# EAGLE design auxboxshield1.54 (EAGLE 6.5.0)
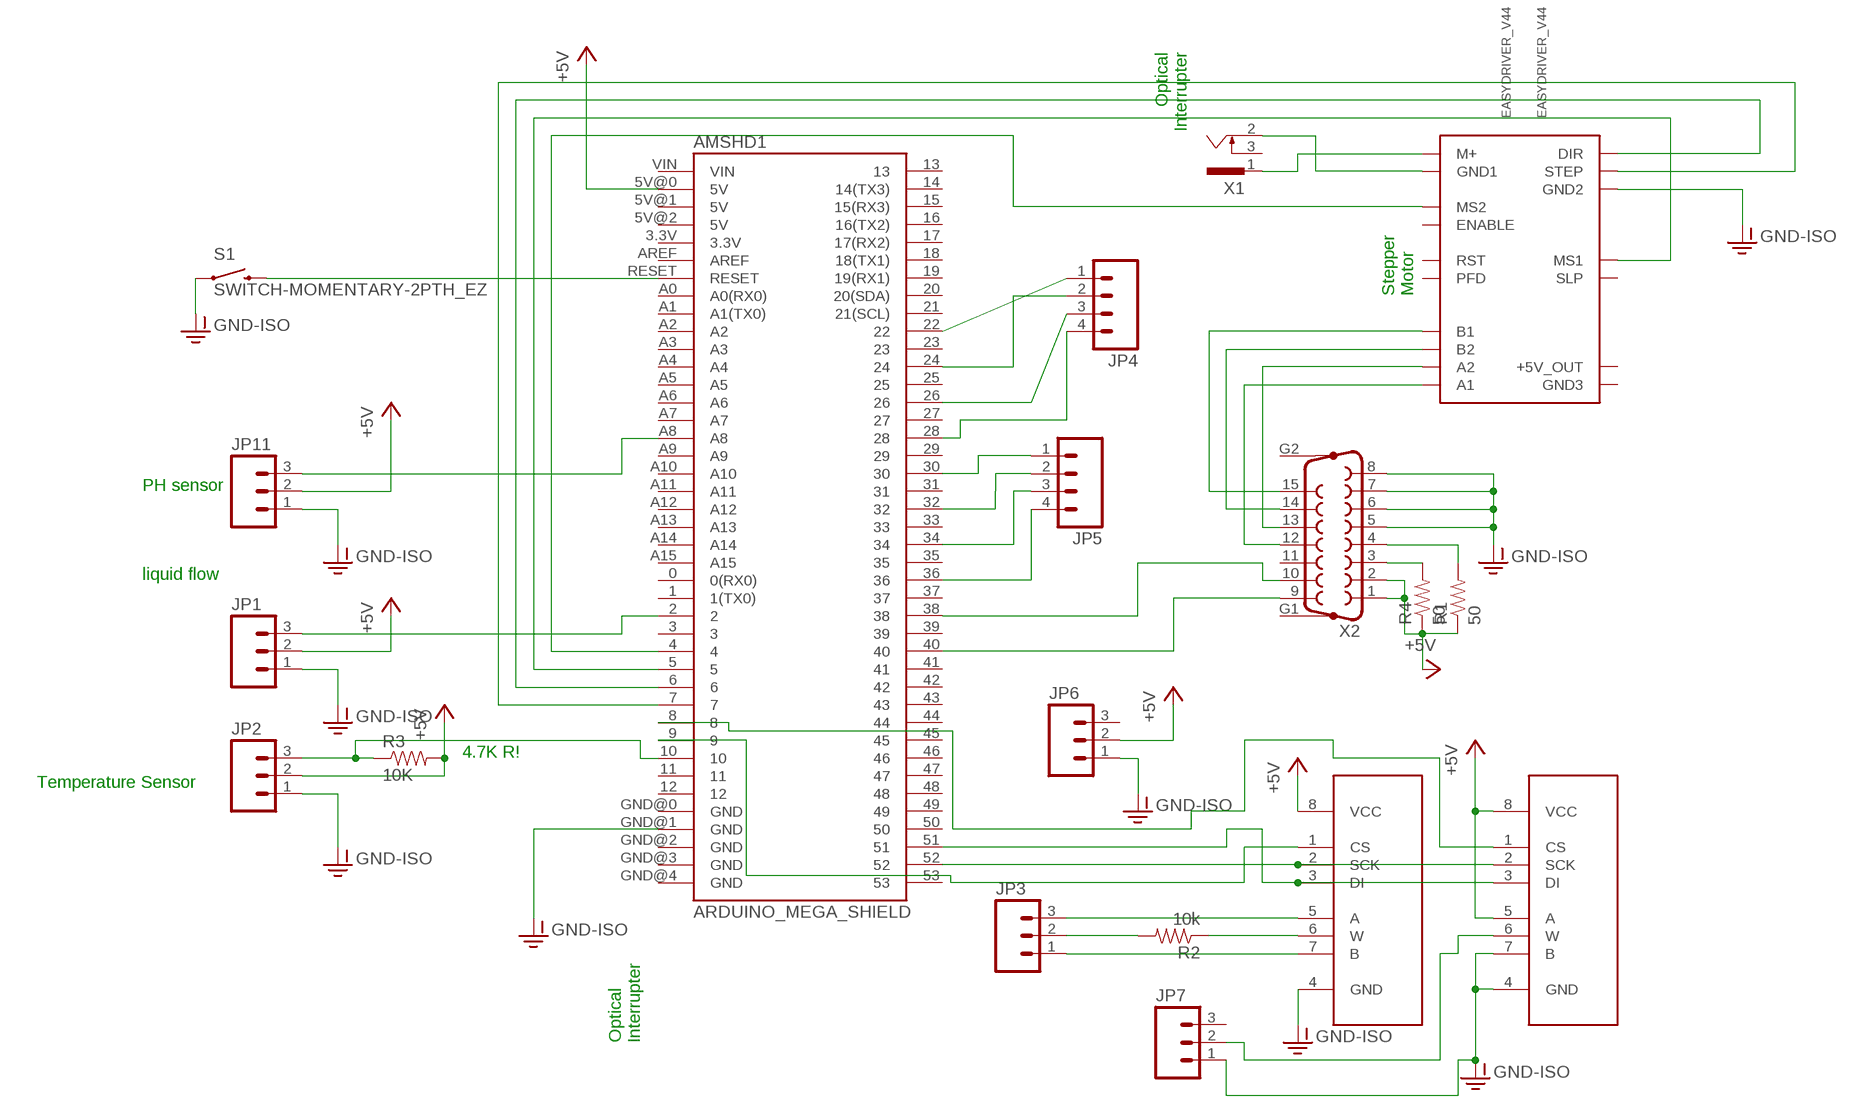
[diagram p0: schematic, sheet 1]

## Parts
AMSHD1  ARDUINO_MEGA_SHIELD  [ARDUINO_MEGA_SHIELD]
EASYDRIVER_V44  EASYDRIVER_V44  [EASYDRIVER_V44]
JP1  M03POLAR  [MOLEX-1X3]
JP2  M03POLAR  [MOLEX-1X3]
JP3  M03POLAR  [MOLEX-1X3]
JP4  M04POLAR  [MOLEX-1X4]
JP5  M04POLAR  [MOLEX-1X4]
JP6  M03POLAR  [MOLEX-1X3]
JP7  M03POLAR  [MOLEX-1X3]
JP11  M03POLAR  [MOLEX-1X3]
R1  50  10OHM-1/4W-5%(PTH)  [AXIAL-0.3]
R2  10k  10KOHM-1/4W-1%(PTH)HORIZ  [AXIAL-0.3]
R3  10K  10OHM-1/4W-5%(PTH)  [AXIAL-0.3]
R4  50  10OHM-1/4W-5%(PTH)  [AXIAL-0.3]
S1  SWITCH-MOMENTARY-2PTH_EZ  [TACTILE-PTH-EZ]
U1  MCP41XXXDIL  [DIL-08]
U2  MCP41XXXDIL  [DIL-08]
X1  SCD-014A  [SCD-014-A]
X2  F15VP  [F15VP]

## Nets
+5V: AMSHD1.5V@0(5V) JP1.2 JP2.2 JP6.2 JP11.2 R1.P$1 R3.P$2 R4.P$1 U1.5(A) U1.8(VCC) U2.8(VCC) X2.1 X2.2
GND-ISO: AMSHD1.GND@1(GND) EASYDRIVER_V44.GND2 JP1.1 JP2.1 JP6.1 JP7.1 JP11.1 S1.1 U1.4(GND) U1.7(B) U2.4(GND) X2.5 X2.6 X2.7 X2.8
N$1: EASYDRIVER_V44.M+ X1.1
N$2: AMSHD1.36 JP5.4
N$3: AMSHD1.38 X2.10
N$4: R1.P$2 X2.4
N$5: AMSHD1.22 JP4.1
N$6: EASYDRIVER_V44.GND1 X1.2
N$7: EASYDRIVER_V44.A1 X2.12
N$8: AMSHD1.24 JP4.2
N$9: AMSHD1.RESET S1.3
N$10: AMSHD1.26 JP4.3
N$11: EASYDRIVER_V44.A2 X2.13
N$12: AMSHD1.9 U2.1(CS)
N$13: AMSHD1.5 EASYDRIVER_V44.MS1
N$14: AMSHD1.28 JP4.4
N$15: AMSHD1.A8 JP11.3
N$16: AMSHD1.4 EASYDRIVER_V44.MS2
N$17: AMSHD1.52 U1.2(SCK) U2.2(SCK)
N$18: AMSHD1.30 JP5.1
N$19: AMSHD1.40 X2.9
N$20: AMSHD1.51 U1.3(DI) U2.3(DI)
N$21: JP3.3 U2.5(A)
N$22: AMSHD1.32 JP5.2
N$23: AMSHD1.34 JP5.3
N$24: R2.P$1 U2.6(W)
N$25: JP3.2 R2.P$2
N$26: AMSHD1.10 JP2.3 R3.P$1
N$27: EASYDRIVER_V44.B2 X2.14
N$28: AMSHD1.2 JP1.3
N$29: AMSHD1.6 EASYDRIVER_V44.DIR
N$30: AMSHD1.7 EASYDRIVER_V44.STEP
N$31: EASYDRIVER_V44.B1 X2.15
N$32: JP3.1 U2.7(B)
N$33: R4.P$2 X2.3
N$34: AMSHD1.8 U1.1(CS)
N$35: JP7.2 U1.6(W)
Unconnected: AMSHD1.0(0(RX0)) AMSHD1.1(1(TX0)) AMSHD1.3 AMSHD1.3.3V AMSHD1.5V@1(5V) AMSHD1.5V@2(5V) AMSHD1.11 AMSHD1.12 AMSHD1.13 AMSHD1.14(14(TX3)) AMSHD1.15(15(RX3)) AMSHD1.16(16(TX2)) AMSHD1.17(17(RX2)) AMSHD1.18(18(TX1)) AMSHD1.19(19(RX1)) AMSHD1.20(20(SDA)) AMSHD1.21(21(SCL)) AMSHD1.23 AMSHD1.25 AMSHD1.27 AMSHD1.29 AMSHD1.31 AMSHD1.33 AMSHD1.35 AMSHD1.37 AMSHD1.39 AMSHD1.41 AMSHD1.42 AMSHD1.43 AMSHD1.44 AMSHD1.45 AMSHD1.46 AMSHD1.47 AMSHD1.48 AMSHD1.49 AMSHD1.50 AMSHD1.53 AMSHD1.A0(A0(RX0)) AMSHD1.A1(A1(TX0)) AMSHD1.A2 AMSHD1.A3 AMSHD1.A4 AMSHD1.A5 AMSHD1.A6 AMSHD1.A7 AMSHD1.A9 AMSHD1.A10 AMSHD1.A11 AMSHD1.A12 AMSHD1.A13 AMSHD1.A14 AMSHD1.A15 AMSHD1.AREF AMSHD1.GND@0(GND) AMSHD1.GND@2(GND) AMSHD1.GND@3(GND) AMSHD1.GND@4(GND) AMSHD1.VIN EASYDRIVER_V44.ENABLE EASYDRIVER_V44.GND3 EASYDRIVER_V44.P$11(+5V_OUT) EASYDRIVER_V44.PFD EASYDRIVER_V44.RST EASYDRIVER_V44.SLEEP(SLP) JP6.3 JP7.3 X1.3 X2.11 X2.G1 X2.G2

## Notes on the sheet
- Optical 
  Interrupter
- Stepper
  Motor
- PH sensor
- liquid flow
- 4.7K R!
- Temperature Sensor
- Optical 
  Interrupter

## Library data of the parts
AMSHD1 = SparkFun-Boards:ARDUINO_MEGA_SHIELD
EASYDRIVER_V44 = EasyDriver:EASYDRIVER_V44: EasyDriver version 4.4 - http://www.schmalzhaus.com/EasyDriver
JP1-JP3 JP6 JP7 JP11 = SparkFun-Connectors:M03: Header 3 Standard 3-pin 0.1" header. Use with straight break away headers (SKU : PRT-00116), right angle break away headers (PRT-00553), swiss pins (PRT-00743), machine pins (PRT-00117), and female headers (PRT-00115). Molex polarized connector foot print use with SKU : PRT-08232 with associated crimp pins and housings.
JP4 JP5 = SparkFun-Connectors:M04: Header 4 Standard 4-pin 0.1" header. Use with straight break away headers (SKU : PRT-00116), right angle break away headers (PRT-00553), swiss pins (PRT-00743), machine pins (PRT-00117), and female headers (PRT-00115). Molex polarized connector foot print use with SKU : PRT-08231 with associated crimp pins and housings. 1MM SMD Version SKU: PRT-10208
R1 R3 R4 = SparkFun-Resistors:10OHM-1/4W-5%(PTH): RES-10698; PROD_ID: RES-10698; VALUE: 10
R2 = SparkFun-Resistors:10KOHM-1/4W-1%(PTH): RES-12183; PROD_ID: RES-12183
S1 = SparkFun-Electromechanical:SWITCH-MOMENTARY-2: Various NO switches- pushbuttons, reed, etc
U1 U2 = SparkFun-AnalogIC:MCP41XXX: SPI controlled single digital potentiometer by Microchip PID: COM-10613
X1 = con-shiua-chyuan:SCD-014A: Power Jack 2.5mm; OC_FARNELL: unknown; OC_NEWARK: unknown
X2 = con-subd:F15VP: SUB-D; OC_FARNELL: unknown; OC_NEWARK: unknown

## Board
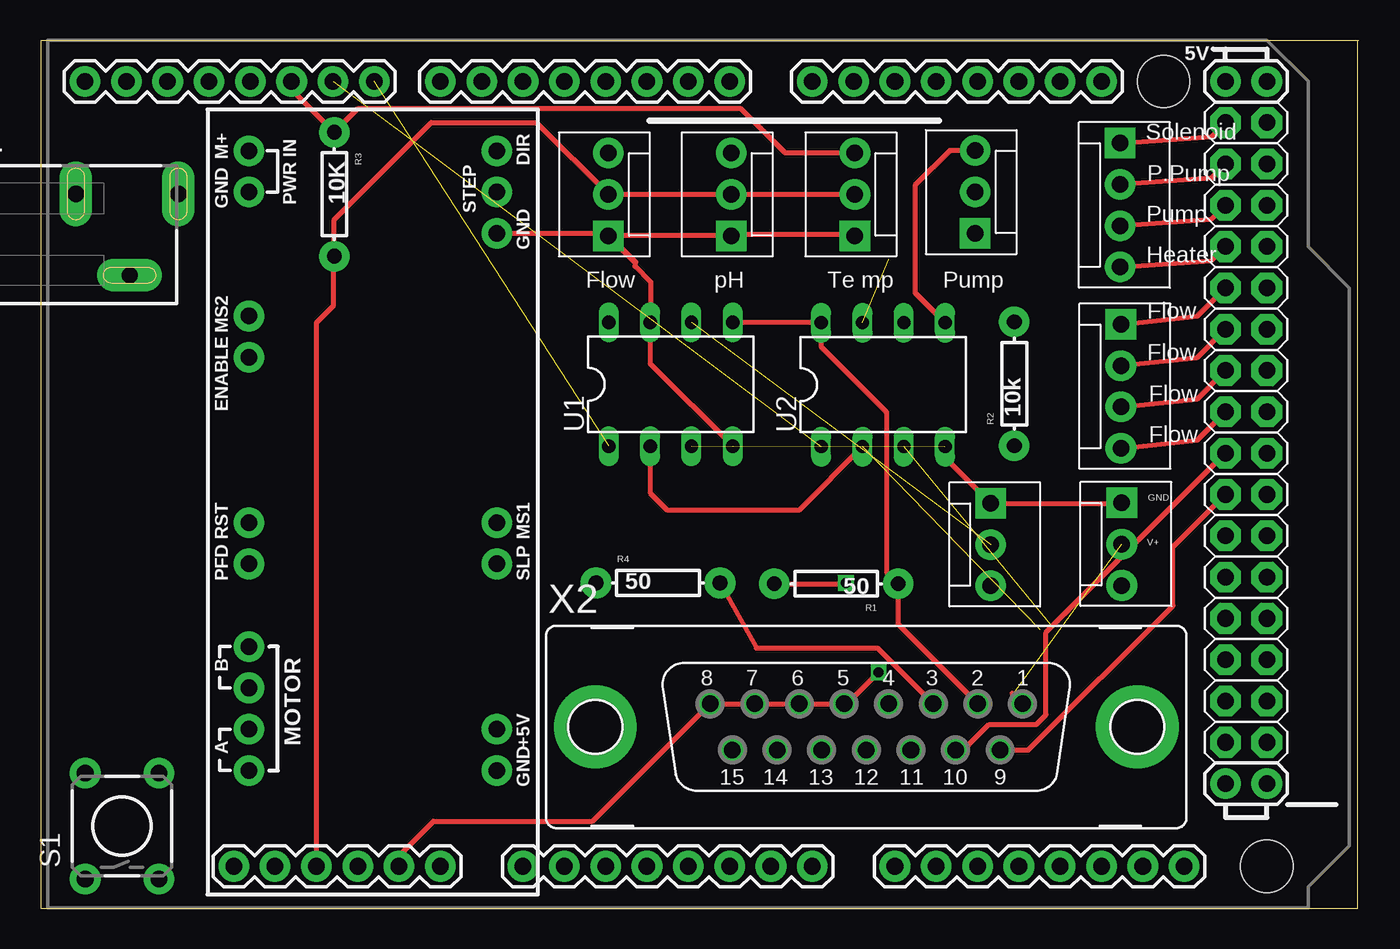
[diagram p1: board, top side]
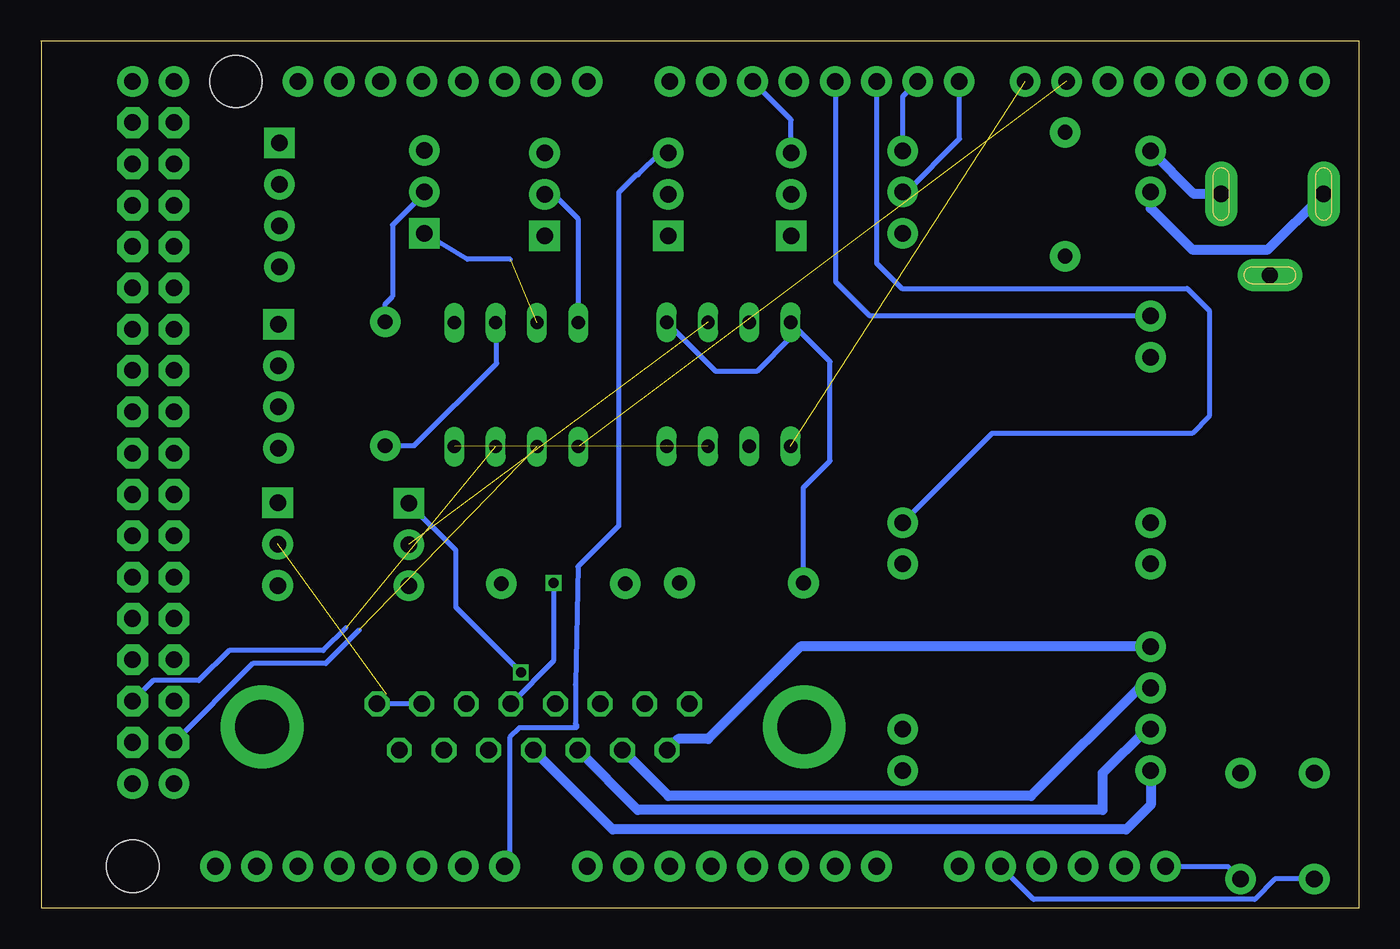
[diagram p2: board, bottom side, seen from below]

Size 81.03 x 53.34 mm. Coordinates in mm from the lower left corner, seen from the top.
Outline: 80.95,53.33 80.95,0 0,0 0,53.33
Outline: 81.03,53.34 0,53.34
Copper layers (1*16): Top 0.0356mm / dielectric 1.5011mm / Bottom 0.0356mm
Design rules "LaenPCBOrder (1)": minimum track width 6mil, minimum drill 13mil, track to track 6mil, track to pad 6mil, pad to pad 6mil, via to via 6mil, smd to smd 6mil, copper to edge 15mil, drill to drill 6mil, minimum pad ring 7mil, minimum via ring 7mil, stop-mask expansion 3mil, vias tented up to drill 0mil, thermal gap 10mil

### Footprints (pad centres in the part's own frame; a part is rotated, then mirrored left to right if it is on the bottom)
ARDUINO_MEGA_SHIELD = drill 1.016 pad 1.88: 0 19.05,27.94; 1 16.51,27.94; 2 13.97,27.94; 3 11.43,27.94; 3.3V -8.89,-20.32; 4 8.89,27.94; 5 6.35,27.94; 5V@0 -6.35,-20.32; 5V@1 49.53,27.94; 5V@2 52.07,27.94; 6 3.81,27.94; 7 1.27,27.94; 8 -2.794,27.94; 9 -5.334,27.94; 10 -7.874,27.94; 11 -10.414,27.94; 12 -12.954,27.94; 13 -15.494,27.94; 14 24.13,27.94; 15 26.67,27.94; 16 29.21,27.94; 17 31.75,27.94; 18 34.29,27.94; 19 36.83,27.94; 20 39.37,27.94; 21 41.91,27.94; A0 6.35,-20.32; A1 8.89,-20.32; A2 11.43,-20.32; A3 13.97,-20.32; A4 16.51,-20.32; A5 19.05,-20.32; A6 21.59,-20.32; A7 24.13,-20.32; A8 29.21,-20.32; A9 31.75,-20.32; A10 34.29,-20.32; A11 36.83,-20.32; A12 39.37,-20.32; A13 41.91,-20.32; A14 44.45,-20.32; A15 46.99,-20.32; AREF -20.574,27.94; GND@0 -3.81,-20.32; GND@1 -1.27,-20.32; GND@2 49.53,-15.24; GND@3 52.07,-15.24; GND@4 -18.034,27.94; RESET -11.43,-20.32; VIN 1.27,-20.32 | drill 1.016 pad 1.88 octagon: 22 49.53,25.4; 23 52.07,25.4; 24 49.53,22.86; 25 52.07,22.86; 26 49.53,20.32; 27 52.07,20.32; 28 49.53,17.78; 29 52.07,17.78; 30 49.53,15.24; 31 52.07,15.24; 32 49.53,12.7; 33 52.07,12.7; 34 49.53,10.16; 35 52.07,10.16; 36 49.53,7.62; 37 52.07,7.62; 38 49.53,5.08; 39 52.07,5.08; 40 49.53,2.54; 41 52.07,2.54; 42 49.53,0; 43 52.07,0; 44 49.53,-2.54; 45 52.07,-2.54; 46 49.53,-5.08; 47 52.07,-5.08; 48 49.53,-7.62; 49 52.07,-7.62; 50 49.53,-10.16; 51 52.07,-10.16; 52 49.53,-12.7; 53 52.07,-12.7 | hole 3.2: 45.72,27.94; 52.07,-20.32
EASYDRIVER_V44 = drill 1.016 pad 1.88: A1 -16.51,7.62; A2 -13.97,7.62; B1 -8.89,7.62; B2 -11.43,7.62; DIR 21.59,-7.62; ENABLE 8.89,7.62; GND1 19.05,7.62; GND2 16.51,-7.62; GND3 -16.51,-7.62; M+ 21.59,7.62; MS1 -1.27,-7.62; MS2 11.43,7.62; P$11 -13.97,-7.62; PFD -3.81,7.62; RST -1.27,7.62; SLEEP -3.81,-7.62; STEP 19.05,-7.62
MOLEX-1X3 = drill 1.016 pad 1.88 square: 1 0,0 | drill 1.016 pad 1.88: 2 2.54,0; 3 5.08,0
MOLEX-1X4 = drill 1.016 pad 1.88 square: 1 0,0 | drill 1.016 pad 1.88: 2 2.54,0; 3 5.08,0; 4 7.62,0
AXIAL-0.3 = drill 0.9 pad 1.88: P$1 -3.81,0; P$2 3.81,0
TACTILE-PTH-EZ = drill 1.016 pad 1.88: 1 -3.251,2.261; 2 3.251,2.261; 3 -3.251,-2.261; 4 3.251,-2.261
DIL-08 = drill 0.813 long: 1 -3.81,-3.81; 2 -1.27,-3.81; 3 1.27,-3.81; 4 3.81,-3.81; 5 3.81,3.81; 6 1.27,3.81; 7 -1.27,3.81; 8 -3.81,3.81
SCD-014-A = drill 1 pad 2 long: 1 -2.5,13.8; 2 -2.5,7.5; 3 2.5,10.8
F15VP = drill 1.016 octagon: 1 9.601,1.422; 2 6.858,1.422; 3 4.115,1.422; 4 1.372,1.422; 5 -1.372,1.422; 6 -4.115,1.422; 7 -6.858,1.422; 8 -9.601,1.422; 9 8.23,-1.422; 10 5.486,-1.422; 11 2.743,-1.422; 12 0,-1.422; 13 -2.743,-1.422; 14 -5.486,-1.422; 15 -8.23,-1.422 | drill 3.302 pad 5.08: G1 -16.662,0; G2 16.662,0

### Placement (x,y rotation side)
AMSHD1  23.3,22.9 0 top
EASYDRIVER_V44  20.41,24.98 90 top
JP1  34.9,41.35 90 top
JP2  50.05,41.35 90 top
JP3  57.45,41.5 90 top
JP4  66.36,47.05 270 top
JP5  66.4,35.9 270 top
JP6  66.46,24.93 270 top
JP7  58.4,24.9 270 top
JP11  42.45,41.35 90 top
R1  48.9,19.95 180 top
R2  59.85,32.25 90 top
R3  18.05,43.9 270 top
R4  37.95,20 0 top
S1  5,5.05 90 top
U1  38.73,32.22 0 top
U2  51.79,32.19 0 top
X1  -5.33,41.42 270 top
X2  50.75,11.15 0 top

### Tracks (layer width: path | path; a pad name or v marks a point on that pad's centre or on a via)
+5V  (1 unrouted)
  Top 0.305: JP2.2 JP11.2 JP1.2 30.49,48.3 24,48.3 18.05,42.35 R3.P$2 18,40.04 18,37.05 16.95,36 AMSHD1.5V@0 | 59.76,13.16 X2.1 59.71,13.21 | X2.2 52.71,17.47 R1.P$1 52,20.66 52,30.5 47.98,34.52 U2.8 47.95,36.02 U1.5
  Bottom 0.305: X2.2 X2.1 | R4.P$1 34.14,25.86 32.5,27.5 32.5,33.6 U1.8 34.92,35.08 37,33 39.52,33 U1.5 | U2.8 47.98,42.37 49.5,43.89 JP2.2
GND-ISO  (via drill 0.6)  (1 unrouted)
  Top 0.305: AMSHD1.GND@1 22.03,3.23 24.15,5.35 33.93,5.35 X2.8 X2.7 X2.6 X2.5 49.57,12.57 v51.5,14.5 | EASYDRIVER_V44.GND2 28.04,41.5 34.75,41.5 JP1.1 JP11.1 41.65,41.45 50.05,41.45 JP2.1 | 36.53,39.72 36.53,39.47 37.5,38.5 37.5,36.06 U1.7 37.47,33.48 U1.4 | U2.4 55.6,27.7 JP7.1 66.43,24.9 JP6.1
  Top 0.406: 36.53,39.72 JP1.1
  Bottom 0.305: S1.1 5.15,1.8 6.4,0.55 20,0.55 AMSHD1.GND@1 | v51.5,14.5 55.5,18.5 55.5,22 JP7.1
N$1
  Bottom 0.61: X1.1 10.14,43.92 EASYDRIVER_V44.M+
N$2
  Top 0.305: JP5.4 71.09,28.78 AMSHD1.36
N$3
  Top 0.305: X2.10 56.73,9.73 58.3,11.3 61.2,11.3 61.8,11.9 61.8,16.95 AMSHD1.38
N$4  (via drill 0.6)
  Top 0.305: R1.P$2 49.45,19.95 v49.5,20
  Bottom 0.305: v49.5,20 49.5,15.19 X2.4
N$5
  Top 0.305: JP4.1 71.98,47.45 AMSHD1.22
N$6
  Bottom 0.61: EASYDRIVER_V44.GND1 12.79,43.04 10.25,40.5 5.58,40.5 X1.2
N$7
  Bottom 0.61: EASYDRIVER_V44.A1 12.79,6.36 14.3,4.85 45.87,4.85 X2.12
N$8
  Top 0.305: JP4.2 71.98,44.91 AMSHD1.24
N$9
  Bottom 0.305: AMSHD1.RESET 8.04,2.58 S1.3
N$10
  Top 0.305: JP4.3 71.98,42.37 AMSHD1.26
N$11
  Bottom 0.61: EASYDRIVER_V44.A2 13.04,11.01 15.75,8.3 15.75,6.05 44.33,6.05 X2.13
N$12  (1 unrouted)
N$13
  Bottom 0.305: AMSHD1.5 29.65,39.65 28.1,38.1 10.55,38.1 9.2,36.75 9.2,30.25 10.25,29.2 22.54,29.2 EASYDRIVER_V44.MS1
N$14
  Top 0.305: JP4.4 71.98,39.83 AMSHD1.28
N$15
  Bottom 0.305: JP11.3 42.97,46.43 44.3,45.1 44.4,45.1 45.5,44 45.5,23.5 48,21 48.15,13.75 48.15,11.35 48.1,11.3 48.1,11.1 51.6,11.1 52.2,10.5 52.2,2.89 AMSHD1.A8
N$16
  Bottom 0.305: EASYDRIVER_V44.MS2 30.06,36.41 32.15,38.5 32.15,50.8 AMSHD1.4
N$17  (1 unrouted)
  Top 0.305: U1.2 37.47,25.54 38.5,24.5 46.63,24.5 U2.2
  Bottom 0.305: 61.45,17.1 63.5,15.05 67.98,15.05 AMSHD1.52
N$18
  Top 0.305: JP5.1 71.09,36.4 AMSHD1.30
N$19
  Top 0.305: X2.9 60.73,9.73 69.6,18.6 69.6,22.21 AMSHD1.40
N$20  (2 unrouted)
  Bottom 0.305: 62.25,17.25 63.65,15.85 69.45,15.85 71.3,14 74.11,14 AMSHD1.51
N$21
  Top 0.305: JP3.3 55.88,46.58 53.75,44.45 53.75,37.85 U2.5
N$22
  Top 0.305: JP5.2 71.09,33.86 AMSHD1.32
N$23
  Top 0.305: JP5.3 71.09,31.32 AMSHD1.34
N$24
  Bottom 0.305: R2.P$1 58.06,28.44 53,33.5 53,35.95 U2.6
N$25
  Bottom 0.305: JP3.2 57.36,44.04 59.4,42 59.4,37.61 59.85,37.16 R2.P$2
N$26
  Top 0.305: AMSHD1.10 15.43,50.33 R3.P$1 19.49,49.15 43.05,49.15 45.77,46.43 JP2.3
N$27
  Bottom 0.61: EASYDRIVER_V44.B2 13.5,13.55 20.15,6.9 42.44,6.9 X2.14
N$28
  Bottom 0.305: JP1.3 34.9,48.47 AMSHD1.2
N$29
  Bottom 0.305: EASYDRIVER_V44.DIR 28.03,49.92 AMSHD1.6
N$30
  Bottom 0.305: EASYDRIVER_V44.STEP 27.82,44.03 24.55,47.3 24.55,50.82 AMSHD1.7
N$31
  Bottom 0.61: EASYDRIVER_V44.B1 34.31,16.09 40,10.4 41.85,10.4 X2.15
N$32  (1 unrouted)
  Bottom 0.305: 52.15,39.9 54.8,39.9 JP3.1
N$33
  Top 0.305: 54.85,12.59 X2.3 51.44,16 44,16 R4.P$2
N$34  (1 unrouted)
N$35  (1 unrouted)

### Text on the board
tPlace: Solenoid | P.Pump | Pump | Heater | Flow | pH | Te mp | Pump | Flow | Flow | Flow | Flow | GND | V+
DrillLegend_01-16: 01-16